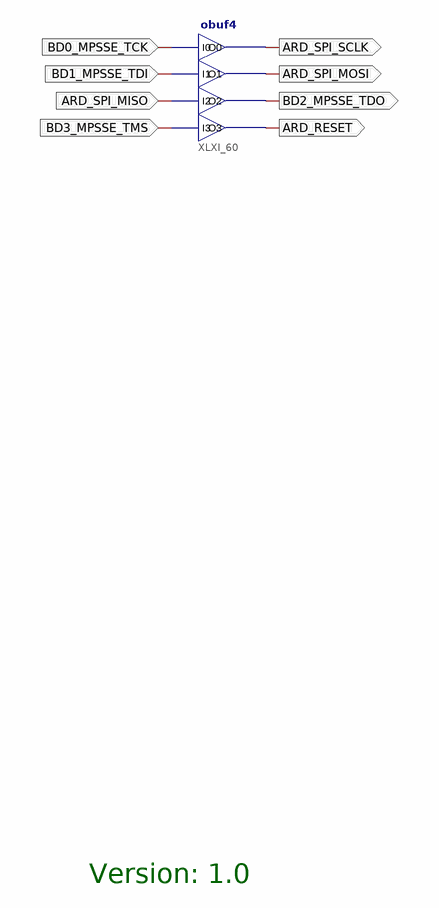
[diagram p0: schematic sheet 1]
// Xilinx ISE schematic Papilio_DUO_LX9.sch (spartan6) as structural Verilog: 1 symbols, 8 ports
module Papilio_DUO_LX9 (
  input  BD0_MPSSE_TCK,
  input  BD1_MPSSE_TDI,
  input  ARD_SPI_MISO,
  input  BD3_MPSSE_TMS,
  output ARD_SPI_SCLK,
  output ARD_SPI_MOSI,
  output BD2_MPSSE_TDO,
  output ARD_RESET
);

  obuf4 XLXI_60 (
    .I0(BD0_MPSSE_TCK), .I1(BD1_MPSSE_TDI), .I2(ARD_SPI_MISO), .I3(BD3_MPSSE_TMS), .O0(ARD_SPI_SCLK),
    .O1(ARD_SPI_MOSI), .O2(BD2_MPSSE_TDO), .O3(ARD_RESET));

  // Notes on the sheet:
  //   Version: 1.0
endmodule
